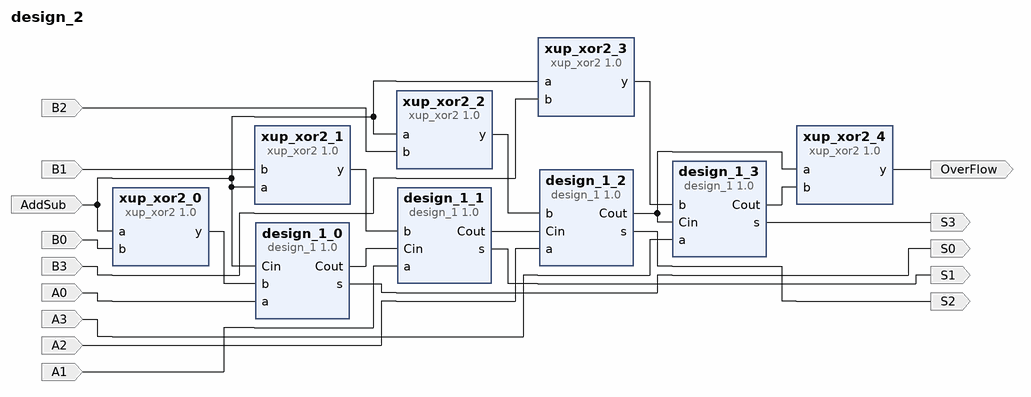
[diagram p0: block diagram of the top level]
# Vivado block design design_2, xc7a100tcsg324-1, Vivado 2019.2
create_bd_design design_2

create_bd_port -dir I AddSub
create_bd_port -dir O OverFlow
create_bd_port -dir O S0
create_bd_port -dir O S2
create_bd_port -dir O S1
create_bd_port -dir O S3
create_bd_port -dir I B0
create_bd_port -dir I B2
create_bd_port -dir I B1
create_bd_port -dir I B3
create_bd_port -dir I A3
create_bd_port -dir I A2
create_bd_port -dir I A1
create_bd_port -dir I A0

create_bd_cell -type ip -vlnv xilinx.com:user:design_1:1.0 design_1_0
create_bd_cell -type ip -vlnv xilinx.com:user:design_1:1.0 design_1_1
create_bd_cell -type ip -vlnv xilinx.com:user:design_1:1.0 design_1_2
create_bd_cell -type ip -vlnv xilinx.com:user:design_1:1.0 design_1_3
create_bd_cell -type ip -vlnv xilinx.com:xup:xup_xor2:1.0 xup_xor2_0
create_bd_cell -type ip -vlnv xilinx.com:xup:xup_xor2:1.0 xup_xor2_1
create_bd_cell -type ip -vlnv xilinx.com:xup:xup_xor2:1.0 xup_xor2_2
create_bd_cell -type ip -vlnv xilinx.com:xup:xup_xor2:1.0 xup_xor2_3
create_bd_cell -type ip -vlnv xilinx.com:xup:xup_xor2:1.0 xup_xor2_4

# ---- connections ----

connect_bd_net [get_bd_pins xup_xor2_0/y] [get_bd_pins design_1_0/b]
connect_bd_net [get_bd_pins xup_xor2_1/y] [get_bd_pins design_1_1/b]
connect_bd_net [get_bd_pins xup_xor2_2/y] [get_bd_pins design_1_2/b]
connect_bd_net [get_bd_pins xup_xor2_3/y] [get_bd_pins design_1_3/b]
connect_bd_net [get_bd_ports AddSub] \
  [get_bd_pins design_1_0/Cin] [get_bd_pins xup_xor2_0/a] [get_bd_pins xup_xor2_1/a] [get_bd_pins xup_xor2_2/a] \
  [get_bd_pins xup_xor2_3/a]
connect_bd_net [get_bd_pins design_1_0/Cout] [get_bd_pins design_1_1/Cin]
connect_bd_net [get_bd_pins design_1_1/Cout] [get_bd_pins design_1_2/Cin]
connect_bd_net [get_bd_pins design_1_2/Cout] [get_bd_pins design_1_3/Cin] [get_bd_pins xup_xor2_4/a]
connect_bd_net [get_bd_pins design_1_3/Cout] [get_bd_pins xup_xor2_4/b]
connect_bd_net [get_bd_pins xup_xor2_4/y] [get_bd_ports OverFlow]
connect_bd_net [get_bd_pins design_1_0/s] [get_bd_ports S0]
connect_bd_net [get_bd_pins design_1_2/s] [get_bd_ports S2]
connect_bd_net [get_bd_pins design_1_1/s] [get_bd_ports S1]
connect_bd_net [get_bd_pins design_1_3/s] [get_bd_ports S3]
connect_bd_net -net b_0_1 [get_bd_ports B0] [get_bd_pins xup_xor2_0/b]
connect_bd_net -net b_1_1 [get_bd_ports B2] [get_bd_pins xup_xor2_2/b]
connect_bd_net -net b_2_1 [get_bd_ports B1] [get_bd_pins xup_xor2_1/b]
connect_bd_net -net b_3_1 [get_bd_ports B3] [get_bd_pins xup_xor2_3/b]
connect_bd_net -net a_0_1 [get_bd_ports A3] [get_bd_pins design_1_3/a]
connect_bd_net -net a_1_1 [get_bd_ports A2] [get_bd_pins design_1_2/a]
connect_bd_net -net a_2_1 [get_bd_ports A1] [get_bd_pins design_1_1/a]
connect_bd_net -net a_3_1 [get_bd_ports A0] [get_bd_pins design_1_0/a]

validate_bd_design
save_bd_design
